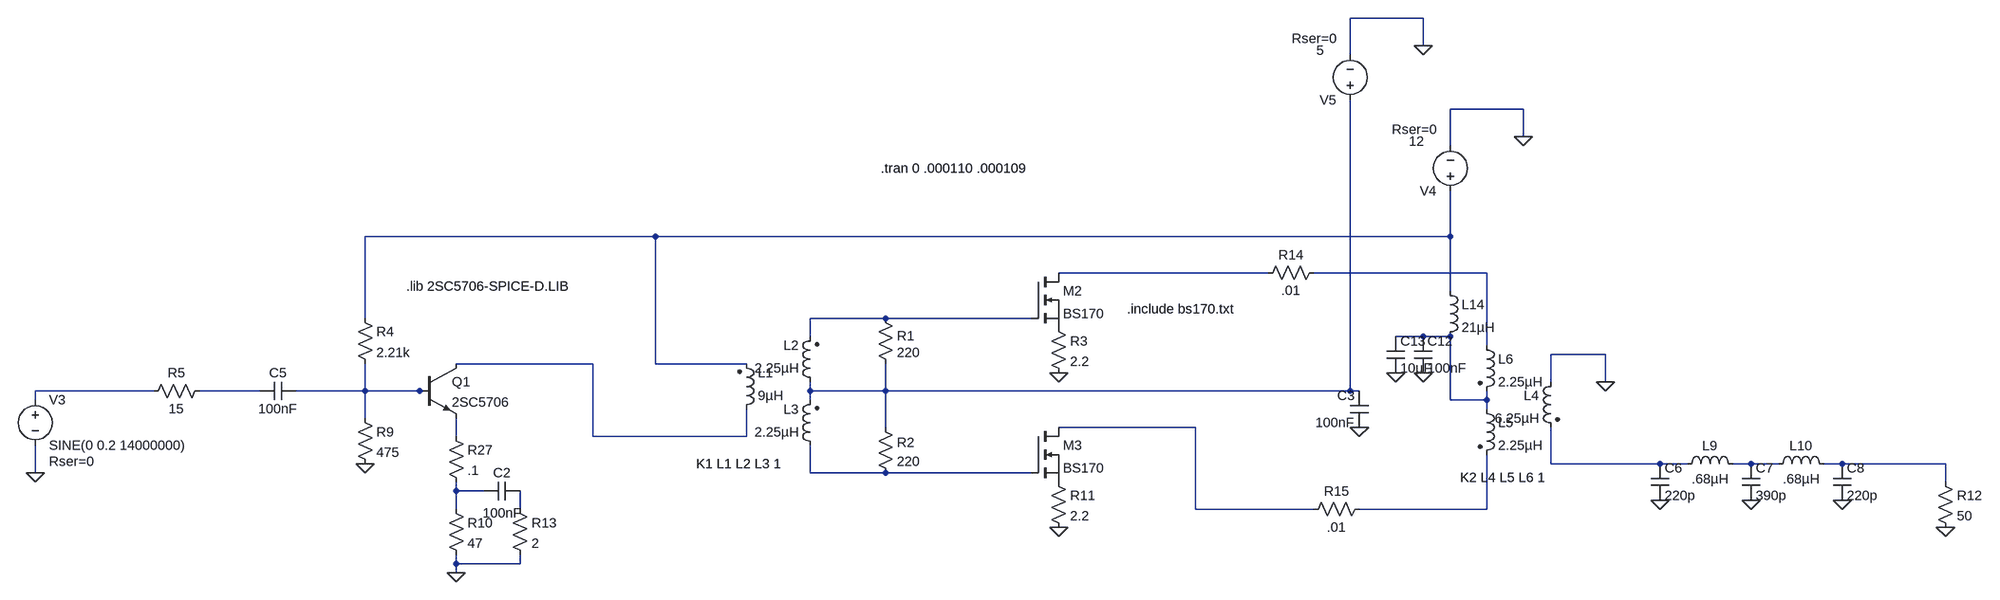
[diagram p0: schematic Amp V3.asc]
Amp V3.asc, the LTspice schematic file:
Version 4
SHEET 1 3352 1348
WIRE 800 -368 672 -368
WIRE 800 -320 800 -368
WIRE 672 -304 672 -368
WIRE 976 -208 848 -208
WIRE 976 -160 976 -208
WIRE 848 -144 848 -208
WIRE -560 16 -1088 16
WIRE 848 16 848 -64
WIRE 848 16 -560 16
WIRE 528 80 160 80
WIRE 912 80 608 80
WIRE 848 112 848 16
WIRE -1088 160 -1088 16
WIRE -144 160 -288 160
WIRE 112 160 -144 160
WIRE -288 192 -288 160
WIRE 800 192 752 192
WIRE 848 192 800 192
WIRE 912 208 912 80
WIRE 1120 224 1024 224
WIRE -688 240 -928 240
WIRE -560 240 -560 16
WIRE -400 240 -560 240
WIRE 1024 272 1024 224
WIRE 1120 272 1120 224
WIRE -1776 288 -1984 288
WIRE -1328 288 -1696 288
WIRE -1088 288 -1088 240
WIRE -1088 288 -1264 288
WIRE -992 288 -1088 288
WIRE -976 288 -992 288
WIRE -288 288 -288 272
WIRE -144 288 -144 240
WIRE -144 288 -288 288
WIRE 672 288 672 -224
WIRE 672 288 -144 288
WIRE 688 288 672 288
WIRE -1984 304 -1984 288
WIRE -288 304 -288 288
WIRE 848 304 848 192
WIRE 912 304 912 288
WIRE 912 304 848 304
WIRE 912 320 912 304
WIRE -1088 336 -1088 288
WIRE -144 352 -144 288
WIRE 400 352 160 352
WIRE -928 368 -928 336
WIRE -688 368 -688 240
WIRE -400 368 -400 320
WIRE -400 368 -688 368
WIRE 1024 416 1024 352
WIRE 1216 416 1024 416
WIRE 1264 416 1216 416
WIRE 1376 416 1344 416
WIRE 1424 416 1376 416
WIRE 1536 416 1504 416
WIRE 1904 416 1536 416
WIRE -1984 432 -1984 384
WIRE -288 432 -288 384
WIRE -144 432 -288 432
WIRE 112 432 -144 432
WIRE 1904 448 1904 416
WIRE -928 464 -928 448
WIRE -880 464 -928 464
WIRE -928 496 -928 464
WIRE -816 496 -816 464
WIRE 400 496 400 352
WIRE 608 496 400 496
WIRE 912 496 912 400
WIRE 912 496 688 496
WIRE -928 592 -928 576
WIRE -816 592 -816 576
WIRE -816 592 -928 592
WIRE -928 608 -928 592
FLAG -1984 432 0
FLAG -1088 416 0
FLAG -928 608 0
FLAG 160 256 0
FLAG 160 528 0
FLAG 1120 272 0
FLAG 1904 528 0
FLAG 976 -160 0
FLAG 688 352 0
FLAG 800 -320 0
FLAG 1216 480 0
FLAG 1376 480 0
FLAG 1536 480 0
FLAG 752 256 0
FLAG 800 256 0
SYMBOL voltage -1984 288 R0
WINDOW 123 0 0 Left 0
WINDOW 39 24 124 Left 2
SYMATTR SpiceLine Rser=0
SYMATTR InstName V3
SYMATTR Value SINE(0 0.2 14000000)
SYMBOL ind2 -416 336 M180
WINDOW 0 36 80 Left 2
WINDOW 3 36 40 Left 2
SYMATTR InstName L1
SYMATTR Value 9µH
SYMATTR Type ind
SYMBOL ind2 -272 288 R180
WINDOW 0 36 80 Left 2
WINDOW 3 36 40 Left 2
SYMATTR InstName L2
SYMATTR Value 2.25µH
SYMATTR Type ind
SYMBOL ind2 -272 400 R180
WINDOW 0 36 80 Left 2
WINDOW 3 36 40 Left 2
SYMATTR InstName L3
SYMATTR Value 2.25µH
SYMATTR Type ind
SYMBOL res -160 144 R0
WINDOW 0 36 47 Left 2
SYMATTR InstName R1
SYMATTR Value 220
SYMBOL res -160 336 R0
WINDOW 0 36 43 Left 2
SYMATTR InstName R2
SYMATTR Value 220
SYMBOL res -1104 144 R0
SYMATTR InstName R4
SYMATTR Value 2.21k
SYMBOL res -1104 320 R0
SYMATTR InstName R9
SYMATTR Value 475
SYMBOL res -944 480 R0
SYMATTR InstName R10
SYMATTR Value 47
SYMBOL nmos 112 80 R0
SYMATTR InstName M2
SYMATTR Value BS170
SYMATTR Prefix X
SYMBOL nmos 112 352 R0
SYMATTR InstName M3
SYMATTR Value BS170
SYMATTR Prefix X
SYMBOL res 144 160 R0
SYMATTR InstName R3
SYMATTR Value 2.2
SYMBOL res 144 432 R0
SYMATTR InstName R11
SYMATTR Value 2.2
SYMBOL ind2 1040 256 M0
SYMATTR InstName L4
SYMATTR Value 6.25µH
SYMATTR Type ind
SYMBOL ind2 896 304 R0
SYMATTR InstName L5
SYMATTR Value 2.25µH
SYMATTR Type ind
SYMBOL ind2 896 192 R0
SYMATTR InstName L6
SYMATTR Value 2.25µH
SYMATTR Type ind
SYMBOL res 1888 432 R0
SYMATTR InstName R12
SYMATTR Value 50
SYMBOL voltage 848 -48 R180
WINDOW 123 0 0 Left 0
WINDOW 39 24 124 Left 2
WINDOW 3 46 103 Left 2
SYMATTR SpiceLine Rser=0
SYMATTR Value 12
SYMATTR InstName V4
SYMBOL cap 704 352 R180
WINDOW 0 24 56 Left 2
WINDOW 3 24 8 Left 2
SYMATTR InstName C3
SYMATTR Value 100nF
SYMBOL cap -816 448 R90
WINDOW 0 0 32 VBottom 2
WINDOW 3 39 31 VTop 2
SYMATTR InstName C2
SYMATTR Value 100nF
SYMBOL res -832 480 R0
SYMATTR InstName R13
SYMATTR Value 2
SYMBOL voltage 672 -208 R180
WINDOW 123 0 0 Left 0
WINDOW 39 24 124 Left 2
WINDOW 3 46 103 Left 2
SYMATTR SpiceLine Rser=0
SYMATTR Value 5
SYMATTR InstName V5
SYMBOL npn -992 240 R0
SYMATTR InstName Q1
SYMATTR Value 2SC5706
SYMBOL res 624 64 R90
WINDOW 0 0 56 VBottom 2
WINDOW 3 32 56 VTop 2
SYMATTR InstName R14
SYMATTR Value .01
SYMBOL res 704 480 R90
WINDOW 0 0 56 VBottom 2
WINDOW 3 32 56 VTop 2
SYMATTR InstName R15
SYMATTR Value .01
SYMBOL cap -1264 272 R90
WINDOW 0 0 32 VBottom 2
WINDOW 3 32 32 VTop 2
SYMATTR InstName C5
SYMATTR Value 100nF
SYMBOL cap 1200 416 R0
SYMATTR InstName C6
SYMATTR Value 220p
SYMBOL cap 1360 416 R0
SYMATTR InstName C7
SYMATTR Value 390p
SYMBOL cap 1520 416 R0
SYMATTR InstName C8
SYMATTR Value 220p
SYMBOL ind 1248 432 R270
WINDOW 0 32 56 VTop 2
WINDOW 3 5 56 VBottom 2
SYMATTR InstName L9
SYMATTR Value .68µH
SYMBOL ind 1408 432 R270
WINDOW 0 32 56 VTop 2
WINDOW 3 5 56 VBottom 2
SYMATTR InstName L10
SYMATTR Value .68µH
SYMBOL res -944 352 R0
SYMATTR InstName R27
SYMATTR Value .1
SYMBOL ind 832 96 R0
SYMATTR InstName L14
SYMATTR Value 21µH
SYMBOL cap 784 192 R0
SYMATTR InstName C12
SYMATTR Value 100nF
SYMBOL cap 736 192 R0
SYMATTR InstName C13
SYMATTR Value 10µF
SYMBOL res -1680 272 R90
WINDOW 0 0 56 VBottom 2
WINDOW 3 32 56 VTop 2
SYMATTR InstName R5
SYMATTR Value 15
TEXT -152 -104 Left 2 !.tran 0 .000110 .000109
TEXT -488 416 Left 2 !K1 L1 L2 L3 1
TEXT 1016 440 Right 2 !K2 L4 L5 L6 1
TEXT 280 144 Left 2 !.include bs170.txt
TEXT -1016 104 Left 2 !.lib 2SC5706-SPICE-D.LIB

The netlist it stands for:
* Amp V3.asc
V3 N007 0 SINE(0 0.2 14000000) Rser=0
L1 N006 N001 9µH
L2 N010 N004 2.25µH
L3 N016 N010 2.25µH
R1 N004 N010 220
R2 N010 N016 220
R4 N001 N009 2.21k
R9 N009 0 475
R10 N017 0 47
XM2 N002 N004 P001 BS170  ; pins D G S
XM3 N011 N016 P002 BS170  ; pins D G S
R3 P001 0 2.2
R11 P002 0 2.2
L4 0 N013 6.25µH
L5 N005 N019 2.25µH
L6 N003 N005 2.25µH
R12 N015 0 50
V4 N001 0 12 Rser=0
C3 0 N010 100nF
C2 N018 N017 100nF
R13 N018 0 2
V5 N010 0 5 Rser=0
Q1 N006 N009 N012 0 2SC5706
R14 N003 N002 .01
R15 N019 N011 .01
C5 N009 N008 100nF
C6 N013 0 220p
C7 N014 0 390p
C8 N015 0 220p
L9 N013 N014 .68µH
L10 N014 N015 .68µH
R27 N012 N017 .1
L14 N001 N005 21µH
C12 N005 0 100nF
C13 N005 0 10µF
R5 N008 N007 15
.model NPN NPN
.model PNP PNP
.lib standard.bjt
.tran 0 .000110 .000109
K1 L1 L2 L3 1
K2 L4 L5 L6 1
.include bs170.txt
.lib 2SC5706-SPICE-D.LIB
.backanno
.end